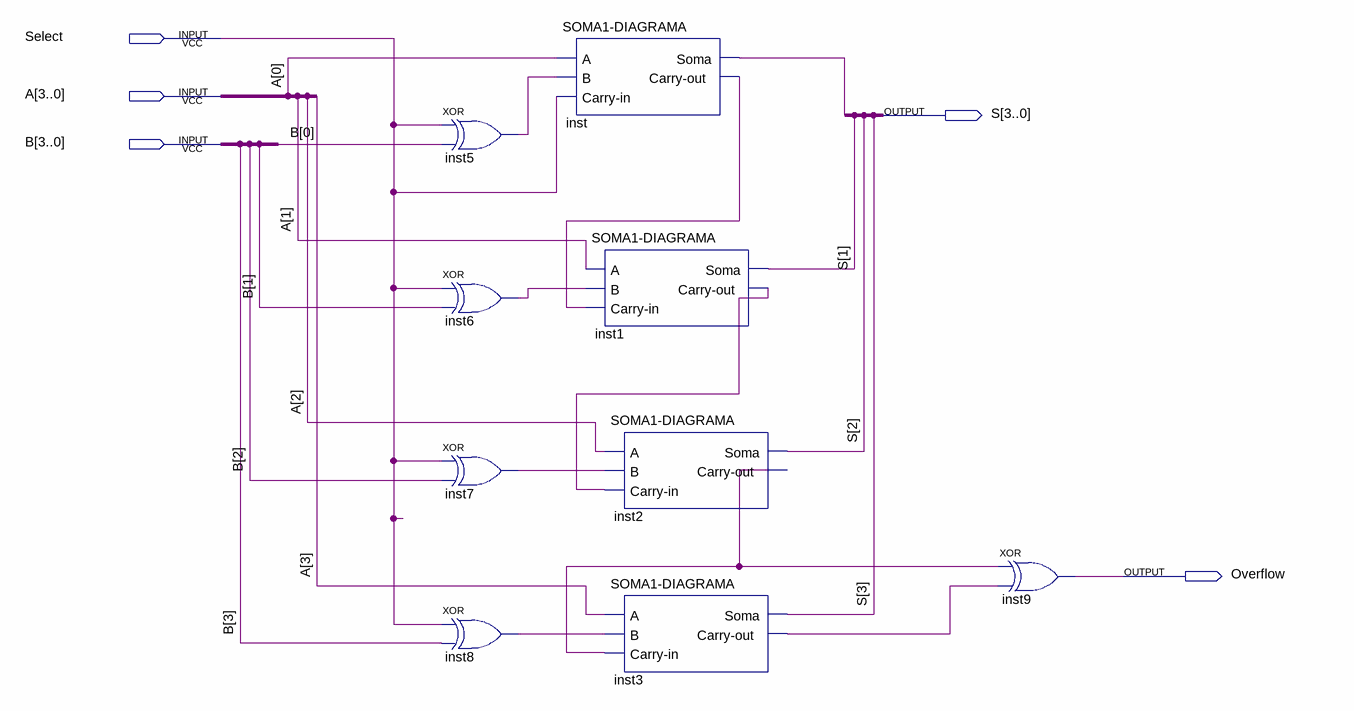
[diagram p0: schematic sheet]
// Quartus schematic SOMA4-DIAGRAMA.bdf as structural Verilog: 9 symbols, 5 pins
module \SOMA4-DIAGRAMA  (
  input  Select,
  input  [3:0] A,
  input  [3:0] B,
  output [3:0] S,
  output Overflow
);

  wire inst1_carry_out, inst2_carry_out, inst3_carry_out, inst5_out, inst6_out, inst7_out, inst8_out,
       inst_carry_out, inst_soma;

  xor inst5 (inst5_out, Select, B[0]);
  xor inst6 (inst6_out, Select, B[1]);
  xor inst7 (inst7_out, Select, B[2]);
  xor inst8 (inst8_out, Select, B[3]);
  \SOMA1-DIAGRAMA  inst (.A(A[0]), .B(inst5_out), .\Carry-in (Select), .Soma(inst_soma), .\Carry-out (inst_carry_out));
  \SOMA1-DIAGRAMA  inst1 (
    .A(A[1]), .B(inst6_out), .\Carry-in (inst_carry_out), .Soma(S[1]), .\Carry-out (inst1_carry_out));
  \SOMA1-DIAGRAMA  inst2 (
    .A(A[2]), .B(inst7_out), .\Carry-in (inst1_carry_out), .Soma(S[2]), .\Carry-out (inst2_carry_out));
  \SOMA1-DIAGRAMA  inst3 (
    .A(A[3]), .B(inst8_out), .\Carry-in (inst2_carry_out), .Soma(S[3]), .\Carry-out (inst3_carry_out));
  xor inst9 (Overflow, inst2_carry_out, inst3_carry_out);
endmodule
